# Altium project Boost and Buck Converter Circuit.PrjPcb
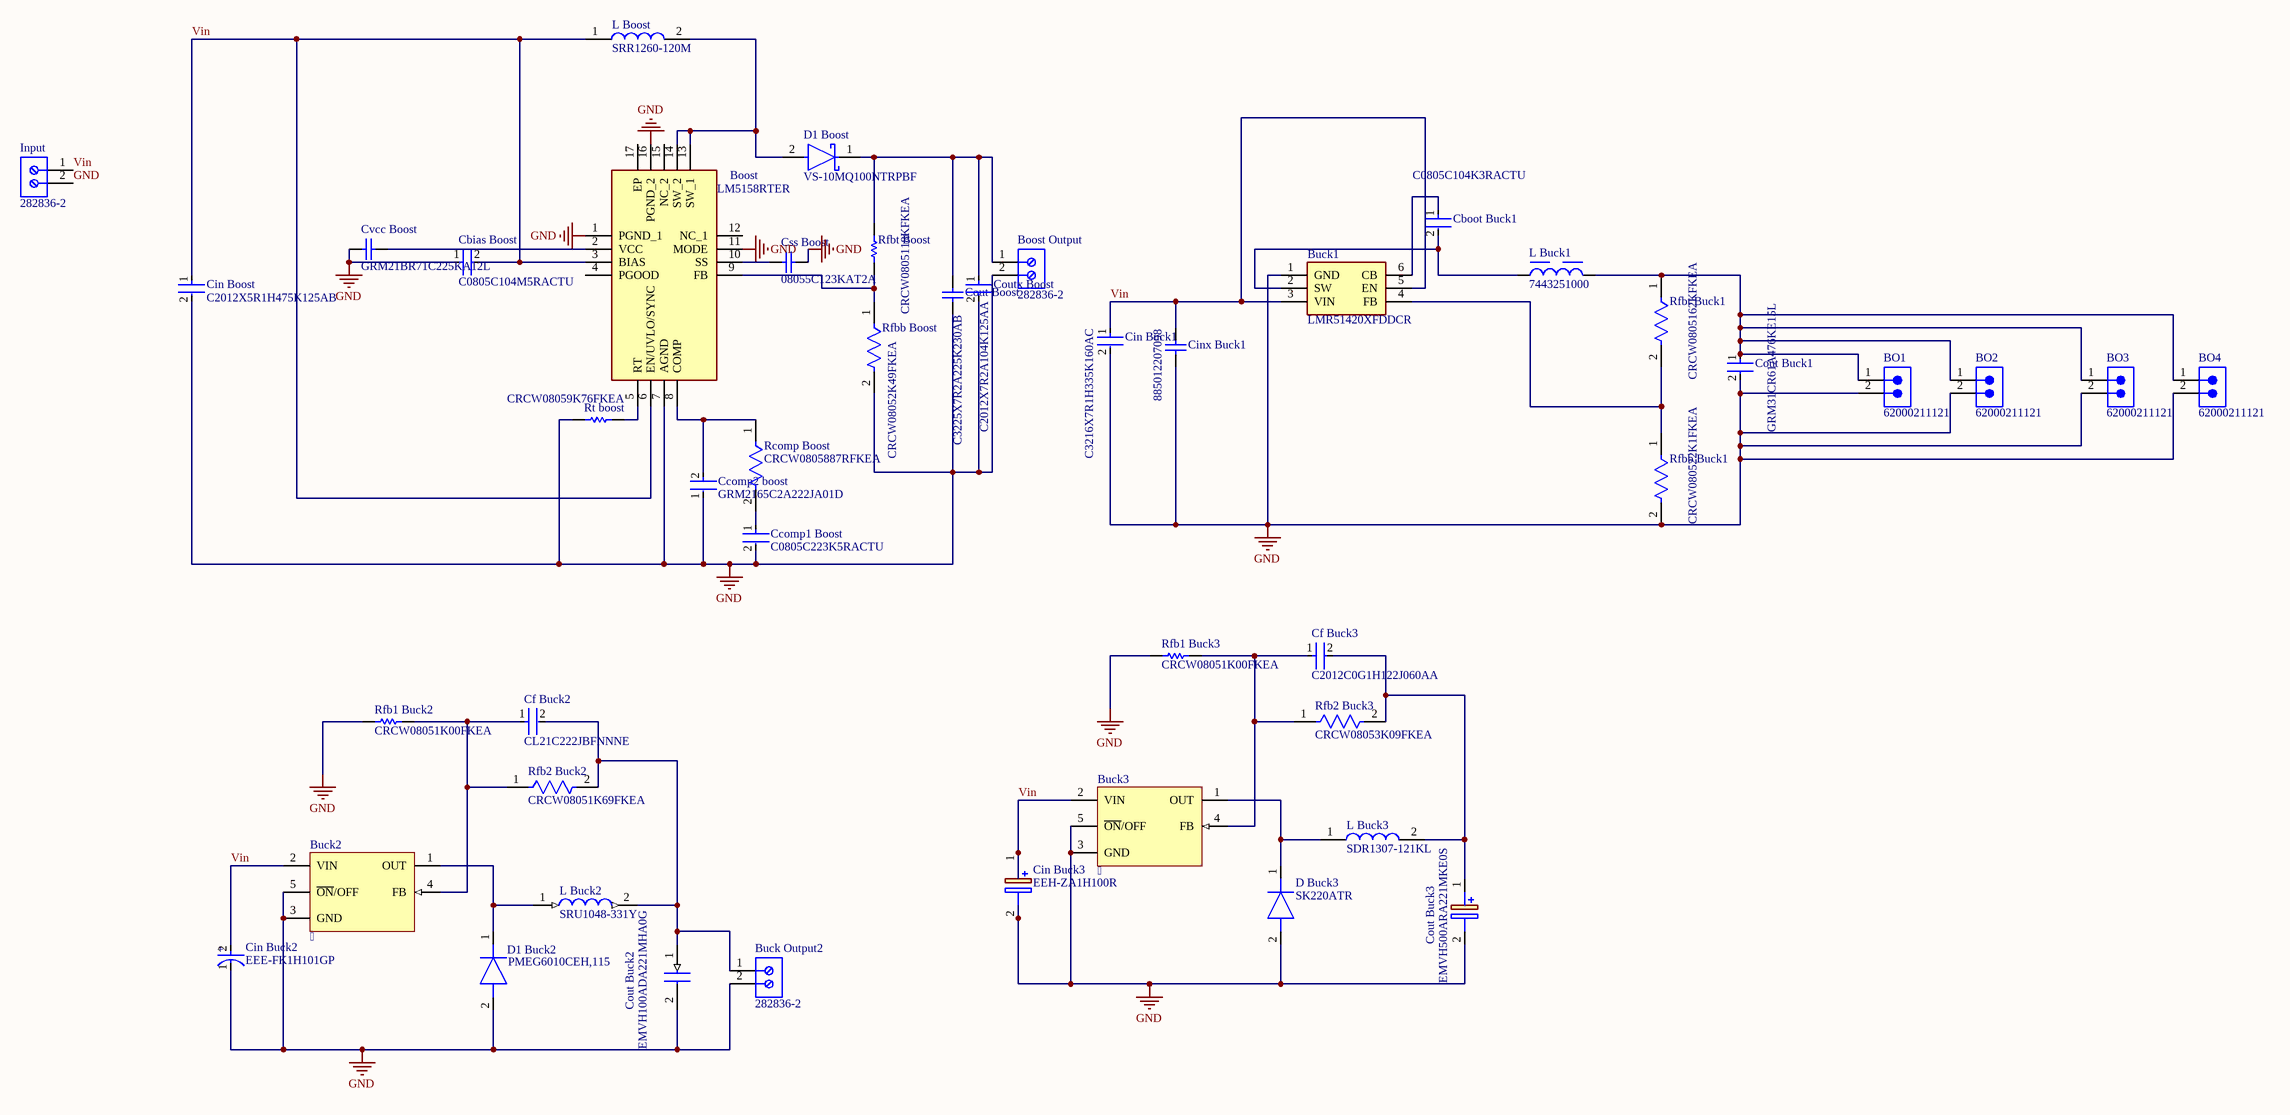
[diagram p0: Power Converter Schematic.SchDoc]
1 sheet, 46 parts. Net scope: global (net labels, ports and power ports of the same name join across sheets).
Board file: Power Converter PCB.PcbDoc

## Sheet Power Converter Schematic.SchDoc
size C; SheetNumber: 1; SheetTotal: 1

### Parts
BO1  62000211121  [62000211121]
BO2  62000211121  [62000211121]
BO3  62000211121  [62000211121]
BO4  62000211121  [62000211121]
Boost  LM5158RTER  [QFN50P300X300X80-17N-D]
Boost_Output  282836-2  [TECO-282836-2_V]
Buck1  LMR51420XFDDCR  [SOT95P280X110-6N]
Buck2    [NDH0005A]
Buck3    [NDH0005A]
Buck_Output2  282836-2  [TECO-282836-2_V]
Cbias_Boost  C0805C104M5RACTU  [FP-C0805C-DN-MFG]
Cboot_Buck1  C0805C104K3RACTU  [FP-C0805C-DN-MFG]
Ccomp1_Boost  C0805C223K5RACTU  [FP-C0805C-DN-MFG]
Ccomp2_boost  GRM2165C2A222JA01D  [FP-GRM216-0_1-IPC_A]
Cf_Buck2  CL21C222JBFNNNE  [FP-CL21-IPC_C]
Cf_Buck3  C2012C0G1H122J060AA  [FP-C2012-060-0_2-IPC_B]
Cin_Boost  C2012X5R1H475K125AB  [FP-C2012-125-0_2-IPC_B]
Cin_Buck1  C3216X7R1H335K160AC  [FP-C3216-160-0_2-IPC_A]
Cin_Buck2  EEE-FK1H101GP  [FP-FKF-MFG]
Cin_Buck3  EEH-ZA1H100R  [EEHZA1H100R]
Cinx_Buck1  885012207098  [WCAP-CSGP_0805_L2W1.25H0.8_Reflow]
Cout_Boost  C3225X7R2A225K230AB  [CAPC3225X250X20LL40]
Cout_Buck1  GRM31CR61A476KE15L  [FP-GRM31C-0_2-e0_3_0_8-MFG]
Cout_Buck2  EMVH100ADA221MHA0G  [CAPAE830X1050N]
Cout_Buck3  EMVH500ARA221MKE0S  [CAPAE1300X1400N]
Coutx_Boost  C2012X7R2A104K125AA  [FP-C2012-125-0_2-IPC_B]
Css_Boost  08055C123KAT2A  [CAPC2013X94X50ML20T25]
Cvcc_Boost  GRM21BR71C225KA12L  [CAPC2013X135X50ML10T20]
D1_Boost  VS-10MQ100NTRPBF  [FP-95400-MFG]
D1_Buck2  PMEG6010CEH,115  [SODFL3516X120N]
D_Buck3  SK220ATR  [DIOM5226X295N]
Input  282836-2  [TECO-282836-2_V]
L_Boost  SRR1260-120M  [SRR1260120M]
L_Buck1  7443251000  [WE-HCI_1050]
L_Buck2  SRU1048-331Y  [INDPM100100X510N]
L_Buck3  SDR1307-121KL  [SDR1307102KL]
Rcomp_Boost  CRCW0805887RFKEA  [FP-CRCW0805-e3-IPC_B]
Rfb1_Buck2  CRCW08051K00FKEA  [RESC2013X50X30NL20T20]
Rfb1_Buck3  CRCW08051K00FKEA  [RESC2013X50X30NL20T20]
Rfb2_Buck2  CRCW08051K69FKEA  [FP-CRCW0805-e3-IPC_A]
Rfb2_Buck3  CRCW08053K09FKEA  [FP-CRCW0805-e3-IPC_C]
Rfbb_Boost  CRCW08052K49FKEA  [FP-CRCW0805-e3-IPC_A]
Rfbb_Buck1  CRCW080522K1FKEA  [FP-CRCW0805-e3-IPC_C]
Rfbt_Boost  CRCW0805118KFKEA  [RESC2013X50X30ML20T20]
Rfbt_Buck1  CRCW0805162KFKEA  [FP-CRCW0805-e3-IPC_C]
Rt_boost  CRCW08059K76FKEA  [RESC2013X50X30NL20T20]

### Nets
GND: BO1.2 BO2.2 BO3.2 BO4.2 Boost.1(PGND_1) Boost.7(AGND) Boost.11(MODE) Boost.16(PGND_2) Boost_Output.2 Buck1.1(GND) Buck2.3(GND) Buck2.5(~{ON}/OFF) Buck3.3(GND) Buck3.5(~{ON}/OFF) Buck_Output2.2 Cbias_Boost.1 Ccomp1_Boost.2 Ccomp2_boost.1 Cin_Boost.2 Cin_Buck1.2 Cin_Buck2.1(C) Cin_Buck3.2(-) Cinx_Buck1.1 Cout_Boost.1 Cout_Buck1.2 Cout_Buck2.2(-) Cout_Buck3.2(-) Coutx_Boost.2 Css_Boost.2 Cvcc_Boost.1 D1_Buck2.2(A) D_Buck3.2(A) Input.2 Rfb1_Buck2.1 Rfb1_Buck3.1 Rfbb_Boost.2 Rfbb_Buck1.2 Rt_boost.2
Vin: Boost.3(BIAS) Boost.6(EN/UVLO/SYNC) Buck1.3(VIN) Buck1.5(EN) Buck2.2(VIN) Buck3.2(VIN) Cbias_Boost.2 Cin_Boost.1 Cin_Buck1.1 Cin_Buck2.2(A) Cin_Buck3.1(+) Cinx_Buck1.2 Input.1 L_Boost.1
NetBO1_1: BO1.1 BO2.1 BO3.1 BO4.1 Cout_Buck1.1 L_Buck1.2 Rfbt_Buck1.1
NetBoost_2: Boost.2(VCC) Cvcc_Boost.2
NetBoost_5: Boost.5(RT) Rt_boost.1
NetBoost_8: Boost.8(COMP) Ccomp2_boost.2 Rcomp_Boost.1
NetBoost_9: Boost.9(FB) Rfbb_Boost.1 Rfbt_Boost.2
NetBoost_10: Boost.10(SS) Css_Boost.1
NetBoost_13: Boost.13(SW_1) Boost.14(SW_2) D1_Boost.2(A) L_Boost.2
NetBoost_Output_1: Boost_Output.1 Cout_Boost.2 Coutx_Boost.1 D1_Boost.1(C) Rfbt_Boost.1
NetBuck1_2: Buck1.2(SW) Cboot_Buck1.2 L_Buck1.1
NetBuck1_4: Buck1.4(FB) Rfbb_Buck1.1 Rfbt_Buck1.2
NetBuck1_6: Buck1.6(CB) Cboot_Buck1.1
NetBuck2_1: Buck2.1(OUT) D1_Buck2.1(K) L_Buck2.1
NetBuck2_4: Buck2.4(FB) Cf_Buck2.1 Rfb1_Buck2.2 Rfb2_Buck2.1
NetBuck3_1: Buck3.1(OUT) D_Buck3.1(K) L_Buck3.1
NetBuck3_4: Buck3.4(FB) Cf_Buck3.1 Rfb1_Buck3.2 Rfb2_Buck3.1
NetBuck_Output2_1: Buck_Output2.1 Cf_Buck2.2 Cout_Buck2.1(+) L_Buck2.2 Rfb2_Buck2.2
NetCcomp1_Boost_1: Ccomp1_Boost.1 Rcomp_Boost.2
NetCf_Buck3_2: Cf_Buck3.2 Cout_Buck3.1(+) L_Buck3.2 Rfb2_Buck3.2

Not connected (* = marked no-connect by the designer): Boost 4(PGOOD) 12(NC_1) 15(NC_2) 17(EP)

### Notes on the sheet
- (in symbol CMP-05427-000032-1) +

### Library data of the parts
BO1-BO4 = CMP-1502-00956-3: NexarPartId: 61924778; Number of Contacts: 2; Voltage Rating: 200V; Gender: Male; Contact Resistance: 20mΩ; Current Rating: 2A; Lead Pitch: 2mm; Max Operating Temperature: 105°C; Contact Material: Gold; Number of Rows: 1; Operating Supply Voltage: 200V; Number of Pins: 2; Orientation: Vertical; Min Operating Temperature: -40°C; Height: 6.35mm; RoHS: Non-Compliant
Boost = LM5158RTER: Integrated Circuit; Manufacturer_Name: Texas Instruments; Datasheet Link: https://www.ti.com/lit/ds/symlink/lm51581.pdf?HQS=dis-dk-null-digikeymode-dsf-pf-null-wwe&ts=1701945457348; Height: 0.8mm; Manufacturer_Part_Number: LM5158RTER; Mouser Part Number: 595-LM5158RTER; Mouser Price/Stock: https://www.mouser.co.uk/ProductDetail/Texas-Instruments/LM5158RTER?qs=A6eO%252BMLsxmSi4gKDMJ7mCQ%3D%3D; Arrow Part Number: LM5158RTER; Arrow Price/Stock: https://www.arrow.com/en/products/lm5158rter/texas-instruments?region=nac
Boost_Output Buck_Output2 Input = CMP-1684-00017-1: Female Header, Pitch 5 mm, 1 x 2 Position, Height 10 mm, Tail Length 3.5 mm, Rohs, Bulk; Manufacturer: TE Connectivity; Wire Gauge: 16-30AWG; Product Training Modules: Wire-to-BoardEurostyleTerminalBlocks; Clamp Material - Plating: Brass-NickelPlated; Voltage: 300V; Mating Orientation: HorizontalwithBoard; Current: 13.5A; Pitch: 0.197"(5.00mm); Screw Thread: M3; 3D Model: 282836-2.pdf; Other Names: 5ULV-02B / A98076; Dynamic Catalog: BuchananSeries; Number of Levels: 1; Torque - Screw: 0.68Nm(6Lb-In); Featured Product: EurostyleTerminalBlockConnectors; Positions Per Level: 2; Wire Termination: Screw-RisingCageClamp; Datasheet URL: http://www.te.com.cn/commerce/DocumentDelivery/DDEController?Action=showdoc&DocId=Catalog+Section%7F1308389_EUROSTYLE_TERMINAL_BLOCKS%7F0607%7Fpdf%7FEnglish%7FENG_CS_1308389_EUROSTYLE_TERMINAL_BLOCKS_0607.pdf%7F282836-2; Color: Green; Family: TerminalBlocks-WiretoBoard; RoHS Information: 282836-2StatementofCompliance; Standard Package: 300; Contact Material - Plating: Brass-TinPlated; Manufacturer URL: http://www.te.com; Housing Material: Polyamide(PA66),Nylon6/6; Features: Interlocking(Side); Package Description: Female Header, Pitch 5 mm, 1 x 2 Position, Height 10 mm, Tail Length 3.5 mm; Mounting Type: ThroughHole; Package Reference: THD; Packaging: Bulk; Series: Buchanan; Category: Connectors,Interconnects; Screw Material - Plating: Brass-NickelPlated
Buck1 = LMR51420XFDDCR: Integrated Circuit; Manufacturer_Name: Texas Instruments; Datasheet Link: https://www.ti.com/lit/ds/symlink/lmr51420.pdf?ts=1662461097045&ref_url=https%253A%252F%252Fwww.ti.com%252Fproduct%252FLMR51420%252Fpart-details%252FLMR51420XFDDCR; Height: 1.1mm; Manufacturer_Part_Number: LMR51420XFDDCR; Mouser Part Number: 595-LMR51420XFDDCR; Mouser Price/Stock: https://www.mouser.co.uk/ProductDetail/Texas-Instruments/LMR51420XFDDCR?qs=vvQtp7zwQdMiXKT41134nA%3D%3D; Arrow Part Number: LMR51420XFDDCR; Arrow Price/Stock: https://www.arrow.com/en/products/lmr51420xfddcr/texas-instruments?region=nac
Buck2 Buck3 = CMP-0069-01920-3: SIMPLE SWITCHER® Power Converter 150 KHz 1A Step-Down Voltage Regulator, 5-pin TO-220, Pb-Free; Manufacturer: Texas Instruments; PackageTopMarking: NSUZXYTTE#*LM2595T*-ADJ P+; PowerWise: N; ComponentLink1Description: Datasheet URL; CompType: Switcher; PackageReference: NDH0005A; ComponentLink1URL: http://www.ti.com/general/docs/lit/getliterature.tsp?genericPartNumber=LM2595&fileType=pdf; PackageDescription: TO-220, Molded, Stagger Bend, 5 Lead; RoHS: Y; PinCount: 5
Cbias_Boost = CMP-1036-04423-3: CAP CER 0.1UF 50V X7R 0805; Manufacturer: KEMET; Tolerance: 0.2; Temperature Coefficient: 30ppm/°C; Capacitance: 0.10 μF; Value: 0.10 μF; Temperature: -55°C to +125°C; RoHS: TRUE; Temperature Range Low: -55°C; Device Class L3: Ceramic Capacitors; Manufacturer Part Number: C0805C104M5RACTU; Octopart: https://octopart.com/c0805c104m5ractu-kemet-129379; Ipc Land Pattern Name: CAPC200125X78; Mouser Description: Multilayer Ceramic Capacitors MLCC - SMD/SMT 50volts 0.1uF X7R 20%; Temperature Range High: +125°C; Material: Ceramic; Package: C0805C-DN; Temperature Characteristic: X7R; Automotive: No; ComponentLink2URL: https://content.kemet.com/datasheets/KEM_C1003_C0G_SMD.pdf; Device Class L1: Passive Components; ComponentLink2Description: Datasheet; Device Class L2: Capacitors; Voltage Rating: 50 V; Digikey Description: CAP CER 0.1UF 50V X7R 0805; Lead Free: Yes; Height: 0.88mm; Category: Cap
Cboot_Buck1 = CMP-2007-01100-2: CAP CER 0.1UF 25V X7R 0805; Manufacturer: KEMET; Capacitance: 0.10 μF; Tolerance: 0.1; Value: 0.10 μF; Temperature Coefficient: 30ppm/°C; Temperature Characteristic: X7R; Octopart: https://octopart.com/c0805c104k3ractu-kemet-136827; Device Class L2: Capacitors; Device Class L1: Passive Components; Category: Cap; Device Class L3: Ceramic Capacitors; Voltage Rating: 25 V; ComponentLink2Description: Datasheet; Automotive: No; Package: C0805C-DN; RoHS: TRUE; Temperature Range High: +125°C; Temperature Range Low: -55°C; Height: 0.88mm; Temperature: -55°C to +125°C; Digikey Description: CAP CER 0.1UF 25V X7R 0805; Ipc Land Pattern Name: CAPC200125X78; Material: Ceramic; Lead Free: Yes; Manufacturer Part Number: C0805C104K3RACTU; ComponentLink2URL: https://content.kemet.com/datasheets/KEM_C1003_C0G_SMD.pdf; Mouser Description: Multilayer Ceramic Capacitor, C Series, 0.1 - F, - 10%, X7R, 25 V, 0805 [2012 Metric] Rohs Compliant: Yes
Ccomp1_Boost = CMP-2007-00338-2: CAP CER 0.022UF 50V X7R 0805; Manufacturer: KEMET; Value: 22,000 pF; Tolerance: 0.1; Temperature Coefficient: 30ppm/°C; Automotive: No; Package: C0805C-DN; RoHS: TRUE; Height: 0.88mm; Lead Free: Yes; Temperature Range Low: -55°C; Digikey Description: CAP CER 0.022UF 50V X7R 0805; ComponentLink2Description: Datasheet; Capacitance: 22,000 pF; Mouser Description: Capacitor; Ceramic; Cap; .022uF; Tol 10%; SMT; Vol-Rtg 50V; X7R; Tape and Reel; Device Class L3: Ceramic Capacitors; Category: Cap; Voltage Rating: 50 V; Temperature Characteristic: X7R; Ipc Land Pattern Name: CAPC200125X78; Manufacturer Part Number: C0805C223K5RACTU; Octopart: https://octopart.com/c0805c223k5ractu-kemet-145968; Device Class L1: Passive Components; Temperature: -55°C to +125°C; Material: Ceramic; ComponentLink2URL: https://content.kemet.com/datasheets/KEM_C1003_C0G_SMD.pdf; Temperature Range High: +125°C; Device Class L2: Capacitors
Ccomp2_boost = CMP-1036-03272-5: Chip Multilayer Ceramic Capacitors for General Purpose, 0805, 2200pF, C0G, 30ppm/°C, 5%, 100V; Capacitance: 2.2nF; Case Code (Metric): 2012; Thickness: 0.028inch; Mount: Surface Mount; Termination: SMD/SMT; Voltage Rating: 100V; Package Quantity: 4000; Max Operating Temperature: 125°C; Case Code (Imperial): 0805; Height: 0.6mm; Dielectric: C0G; Radiation Hardening: No; Case/Package: 0805; Packaging: Tape and Reel; Depth: 1.25mm; Construction: Flat; RoHS Compliant: Yes; Width: 0.049inch; Tolerance: 5%; Length: 2mm; Voltage Rating (DC): 100V; Series: GRM; Min Operating Temperature: -55°C
Cf_Buck2 = CMP-13271-001564-1: CL21 Series 0805 2.2nF 50V ±5% Tolerance C0G Multilayer Ceramic Chip Capacitor; Mount: Surface Mount; Packaging: Tape and Reel; Tolerance: 5%; Thickness: 0.053inch; Case Code (Imperial): 0805; Capacitance: 2.2nF; Min Operating Temperature: -55°C; Width: 0.049inch; Package Quantity: 2000; Depth: 1.25mm; Radiation Hardening: No; Voltage Rating (DC): 50V; Case/Package: 0805; Voltage: 50V; Max Operating Temperature: 125°C; Case Code (Metric): 2012; Voltage Rating: 50V; Length: 2mm; Dielectric: C0G; Height: 1.25mm; Lead Free: Lead Free
Cf_Buck3 = CMP-08246-006887-1: Multilayer Ceramic Capacitors 1.2nF ±5% 50V C0G SMD 0805; Temperature Coefficient: 30ppm/°C; REACH SVHC: No SVHC; Max Operating Temperature: 125°C; Length: 2mm; Voltage Rating (DC): 50V; Termination: SMD/SMT; Packaging: Tape and Reel; Min Operating Temperature: -55°C; Case Code (Imperial): 0805; Voltage Rating: 50V; Dielectric Material: Ceramic; Voltage: 50V; Series: C; Weight: 0.000194oz; Width: 0.049inch; Radiation Hardening: No; Mount: Surface Mount; Tolerance: 5%; Lead Free: Lead Free; Thickness: 0.028inch; Height: 0.6mm; Capacitance: 1.2nF; Construction: Flat; Case Code (Metric): 2012; Dielectric: C0G; Case/Package: 0805; Depth: 1.25mm; RoHS Compliant: Yes; Package Quantity: 1
Cin_Boost = CMP-08246-000007-2: Multilayer Ceramic Capacitors 4.7μF ±10% 50V X5R SMD 0805; Capacitance: 4.7uF; Case Code (Metric): 2012; Weight: 0.000194oz; Voltage Rating: 50V; Voltage: 50V; Construction: Flat; Series: C; Packaging: Tape and Reel; Height: 1.25mm; Depth: 1.25mm; Resistor Type: Ceramic; Width: 0.049inch; Length: 2mm; Thickness: 0.057inch; REACH SVHC: No SVHC; Max Operating Temperature: 85°C; Case/Package: 0805; Dielectric: X5R; Tolerance: 10%; Dielectric Material: Ceramic; Package Quantity: 1; Mount: Surface Mount; Radiation Hardening: No; Voltage Rating (DC): 50V; Case Code (Imperial): 0805; Termination: SMD/SMT; Min Operating Temperature: -55°C; Lead Free: Lead Free
Cin_Buck1 = CMP-08246-006965-1: Multilayer Ceramic Capacitors 3.3uF ±10% 50V X7R SMD 1206; Package Quantity: 1; Construction: Flat; Depth: 1.6mm; Packaging: Tape and Reel; Mount: Surface Mount; Max Operating Temperature: 125°C; Resistor Type: Ceramic; Tolerance: 10%; Capacitance: 3.3uF; Termination: SMD/SMT; REACH SVHC: No SVHC; Lead Free: Lead Free; Dielectric: X7R; Height: 1.6mm; Radiation Hardening: No; Width: 1.6mm; Voltage Rating: 50V; Case Code (Imperial): 1206; Series: C; Case Code (Metric): 3216; RoHS Compliant: Yes; Case/Package: 1206; Dielectric Material: Ceramic; Thickness: 0.051inch; Min Operating Temperature: -55°C; Weight: 0.000571oz; Length: 3.2mm; Voltage Rating (DC): 50V
Cin_Buck2 = CMP-05427-000032-1: CAP ALUM 100UF 20% 50V SMD; Ripple Current (AC): 350mA; Impedance: 340mR; Life (Hours): 5000Hour; Leakage Current: 10mA; Voltage: 50V; Voltage Rating (DC): 50V; ESR (Equivalent Series Resistance): 340mR; Packaging: Tape and Reel; Radiation Hardening: No; Construction: Cylindrical; Case/Package: SMD/SMT; Contact Plating: Tin; Min Operating Temperature: -55°C; Lead Free: Lead Free; Mount: Surface Mount; Number of Pins: 2; Height: 10.2mm; Tolerance: 20%; Package Quantity: 1; Voltage Rating: 50V; Termination: SMD/SMT; Width: 10mm; Max Operating Temperature: 105°C; Height - Seated (Max): 0.402inch; RoHS Compliant: Yes; Ripple Current: 350mA; Length: 10.2mm; Capacitance: 100uF; Series: FK; REACH SVHC: No SVHC; Diameter: 8mm
Cin_Buck3 = EEH-ZA1H100R: Capacitor Polarised; Manufacturer_Name: Panasonic; Datasheet Link: http://industrial.panasonic.com/cdbs/www-data/pdf/RDD0000/ABA0000C1221.pdf; Height: 6.1mm; Manufacturer_Part_Number: EEH-ZA1H100R; Mouser Part Number: 667-EEH-ZA1H100R; Mouser Price/Stock: https://www.mouser.co.uk/ProductDetail/Panasonic/EEH-ZA1H100R?qs=7UCyOFMWVHYLkHnrAgGq6g%3D%3D; Arrow Part Number: EEH-ZA1H100R; Arrow Price/Stock: https://www.arrow.com/en/products/eehza1h100r/panasonic
Cinx_Buck1 = CMP-03913-65419869-1: 885012207098 Ceramic Capacitor, Multilayer, Ceramic, 50V, 10% +Tol, 10% -Tol, X7R, 15% TC, 0.1uF, Surface Mount, 0805; Capacitance: 100nF; Insulation Resistance: 5GΩ; RoHS: Compliant; Height: 800µm; Tolerance: 10%; Voltage Rating (DC): 50V; Packaging: Tape & Reel (TR); Case Code (Metric): 2012; NexarPartId: 65419869; Mount: Surface Mount; Width: 1.25mm; Min Operating Temperature: -55°C; Dielectric: X7R; Max Operating Temperature: 125°C; Material: Ceramic; Case Code (Imperial): 0805; REACH SVHC: Unknown; Thickness: 889µm; Voltage Rating: 50V; Length: 2mm; Case/Package: 0805
Cout_Boost = CMP-2000-06053-1: Chip Capacitor, 2.2 uF, +/- 10%, -55 to 125 degC, 1210 (3225 Metric), RoHS, Tape and Reel; PCN Part Number: MLCCPartNumberChange30/Nov/2012; Manufacturer: TDK; Capacitance: 2.2µF; Catalog Drawings: CSERIES_1210_2.5; Product Training Modules: SEAT,CCV,andTVCLDesignToolsGuidetoReplacinganElectrolyticCapacitorwithanMLCC; Other Names: 445-4497-6; Voltage - Rated: 100V; Temperature Coefficient: X7R; Featured Product: C-SeriesMidVoltageMLCCs; Online Catalog: CSeries,MidVoltage; Ratings: -; Mounting Technology: SurfaceMount; Height - Seated (Max): -; Applications: GeneralPurpose; Packaging: Digi-Reel®; Mounting Type: SurfaceMount,MLCC; Lead Spacing: -; Thickness (Max): 0.098"(2.50mm); Package Reference: 1210 (3225 Metric); Manufacturer URL: http://www.tdk.com/; Size / Dimension: 0.126"Lx0.098"W(3.20mmx2.50mm); Operating Temperature: -55°C~125°C; Datasheet URL: https://datasheet.ciiva.com/15192/getdatasheetpartid-725361-15192330.pdf; RoHS Information: RoHSCertificate-MLCC; Lead Style: -; Standard Package: 1; Family: CeramicCapacitors; Datasheet Version: 10/2014; Category: Capacitors; Tolerance: ±10%; Features: -; Series: C; Package Description: 2-Pin Surface Mount Device, Body 3.2 x 2.5 mm; Package / Case: 1210(3225Metric)
Cout_Buck1 = CMP-06035-015661-1: Chip Multilayer Ceramic Capacitors for General Purpose, 1206, 47uF, X5R, 15%, 10%, 10V; Case/Package: 1206; Min Operating Temperature: -55°C; REACH SVHC: No SVHC; Mount: Surface Mount; Height: 1.6mm; Thickness: 0.071inch; Packaging: Tape and Reel; Tolerance: 10%; Dielectric: X5R; Case Code (Imperial): 1206; Lead Free: Lead Free; Width: 1.6mm; Voltage Rating (DC): 10V; Material: Ceramic; Max Operating Temperature: 85°C; Voltage: 10V; Package Quantity: 2000; Case Code (Metric): 3216; Termination: SMD/SMT; Voltage Rating: 10V; Depth: 1.6mm; Length: 3.2mm; Capacitance: 47uF
Cout_Buck2 = EMVH100ADA221MHA0G: Capacitor; Manufacturer_Name: Chemi-Con; Datasheet Link: https://www.mouser.com/datasheet/2/420/MVHRA_e-2509159.pdf; Height: 10.5mm; Manufacturer_Part_Number: EMVH100ADA221MHA0G
Cout_Buck3 = EMVH500ARA221MKE0S: Capacitor Polarised; Manufacturer_Name: Chemi-Con; Datasheet Link: https://datasheet.datasheetarchive.com/originals/distributors/Datasheets_SAMA/00faa400e29ccc6bfe274dba95f85cbe.pdf; Height: 14mm; Manufacturer_Part_Number: EMVH500ARA221MKE0S; Mouser Part Number: 661-MVH50V221M; Mouser Price/Stock: https://www.mouser.co.uk/ProductDetail/Chemi-Con/EMVH500ARA221MKE0S?qs=2mc6vmdPgIHrG5zINcyyrQ%3D%3D
Coutx_Boost = CMP-08246-005364-1: Multilayer Ceramic Capacitors 100nF ±10% 100V X7R SMD 0805; Packaging: Tape and Reel; Length: 2mm; Number of Pins: 2; Voltage Rating: 100V; Min Operating Temperature: -55°C; Height: 1.25mm; Radiation Hardening: No; Termination: SMD/SMT; Weight: 0.000194oz; Case Code (Imperial): 0805; Max Operating Temperature: 125°C; Voltage: 100V; Capacitance: 100nF; Thickness: 0.057inch; Width: 0.049inch; Resistor Type: Ceramic; Package Quantity: 1; Tolerance: 10%; Mount: Surface Mount; Depth: 1.25mm; Series: C; Lead Free: Lead Free; Case/Package: 0805; Voltage Rating (DC): 100V; Dielectric: X7R; Case Code (Metric): 2012; RoHS Compliant: Yes; REACH SVHC: No SVHC; Construction: Flat
Css_Boost = CMP-2007-04376-1: Manufacturer: AVX Interconnect / Elco; Part Number: 08055C123KAT2A
Cvcc_Boost = CMP-2007-03455-1: Manufacturer: Murata; Part Number: GRM21BR71C225KA12L
D1_Boost = CMP-02539-000001-1: DIODE SCHOTTKY 100V 1A SMA; Manufacturer: Vishay; Forward Current: 1.5A; Max Surge Forward Current: 30A; Standoff Height: 0mm; Value: 38pF; Max Junction Temp: +150°C; Peak Reverse Current: 0.1mA; Octopart: https://octopart.com/vs-10mq100ntrpbf-vishay-44340924; Max Repetitive Reverse Voltage: 100V; ComponentLink2Description: Datasheet; ComponentLink2URL: http://www.vishay.com/docs/94119/vs-10mq100ntrpbf.pdf; Reverse Voltage: 100V; Digikey Description: DIODE SCHOTTKY 100V 1A SMA; Mouser Description: DIODE SCHOTTKY 100V 1A SMA; Lead Free: Yes; Device Class L2: Diodes; Temperature Range Low: -55°C; Package: 95400; Height: 2.29mm; Capacitance: 38pF; Device Class L1: Discrete Semiconductors; Footprint Url: https://www.vishay.com/docs/95400/sma.pdf; Temperature: -55°C to +150°C; Temperature Range High: +150°C; RoHS: TRUE; Category: Diode; Manufacturer Part Number: VS-10MQ100NTRPBF; Device Class L3: Schottky Diodes; Automotive: No
D1_Buck2 = PMEG6010CEH,115: Diode; Manufacturer_Name: Nexperia; Datasheet Link: https://assets.nexperia.com/documents/data-sheet/PMEG6010CEH_PMEG6010CEJ.pdf; Height: 1.2mm; Manufacturer_Part_Number: PMEG6010CEH,115; Mouser Part Number: 771-PMEG6010CEH-T/R; Mouser Price/Stock: https://www.mouser.co.uk/ProductDetail/Nexperia/PMEG6010CEH115?qs=LOCUfHb8d9uyulDQGIpcOA%3D%3D; Arrow Part Number: PMEG6010CEH,115; Arrow Price/Stock: https://www.arrow.com/en/products/pmeg6010ceh115/nexperia?region=europe
D_Buck3 = SK220ATR: Diode; Manufacturer_Name: SMC Diode Solutions; Datasheet Link: http://www.smc-diodes.com/propdf/SK220A%20N0942%20REV.B.pdf; Height: 2.95mm; Manufacturer_Part_Number: SK220ATR
L_Boost = SRR1260-120M: Inductor; Manufacturer_Name: Bourns; Datasheet Link: https://www.bourns.com/docs/Product-Datasheets/SRR1260.pdf; Height: 6.5mm; Manufacturer_Part_Number: SRR1260-120M; Mouser Part Number: 652-SRR1260-120M; Mouser Price/Stock: https://www.mouser.co.uk/ProductDetail/Bourns/SRR1260-120M?qs=%2FPiZ59IM4y1THIjATaheJA%3D%3D; Arrow Part Number: SRR1260-120M; Arrow Price/Stock: https://www.arrow.com/en/products/srr1260-120m/bourns?region=nac
L_Buck1 = CMP-03913-24533220-1: 7443251000 Power Choke Shielded Wirewound 10uH/7.6uH 20% 100KHz 7.2A 16.3mOhm DCR T/R; Series Resistance: 16.3Ω; Inductance: 10µH; Self Resonant Frequency: 21MHz; DC Resistance (DCR): 16.3mΩ; Saturation Current: 8.5A; Tolerance: 20%; Ambient Temperature Range High: 100°C; Ambient Temperature Range Low: -40°C; Max DC Current: 7.2A; Packaging: Digi-Reel®; Height - Seated (Max): 5.0038mm; NexarPartId: 24533220; Number of Pins: 2; RMS Current (Irms): 7.2A; Case/Package: Nonstandard; Composition: Wirewound; Inductance Tolerance: 20%; Width: 10.2mm; Shielding: Shielded; Lead Free: Lead Free; Length: 10.5mm; Min Operating Temperature: -40°C; Max Operating Temperature: 150°C; Current Rating: 7.2A; REACH SVHC: Unknown; Height: 4.7mm; RoHS: Compliant; Termination: SMD/SMT; Mount: Surface Mount; Test Frequency: 100kHz
L_Buck2 = SRU1048-331Y: Inductor; Manufacturer_Name: Bourns; Datasheet Link: http://uk.rs-online.com/web/p/products/1729735; Height: 5.1mm; Manufacturer_Part_Number: SRU1048-331Y
L_Buck3 = SDR1307-121KL: Inductor; Manufacturer_Name: Bourns; Datasheet Link: https://datasheet.datasheetarchive.com/originals/dk/DKDS-12/225042.pdf; Height: 7.3mm; Manufacturer_Part_Number: SDR1307-121KL; Mouser Part Number: 652-SDR1307-121KL; Mouser Price/Stock: https://www.mouser.co.uk/ProductDetail/Bourns/SDR1307-121KL?qs=y9m3SKnhpLM5rTTayljzjg%3D%3D; Arrow Part Number: SDR1307-121KL; Arrow Price/Stock: https://www.arrow.com/en/products/sdr1307-121kl/bourns
Rcomp_Boost = CMP-2001-04145-2: RES Thick Film, 887Ω, 1%, 0.125W, 100ppm/°C, 0805; Power Rating: 125mW; Voltage Rating (DC): 150V; Resistance: 887R; Contact Plating: Tin; Packaging: Tape and Reel; Width: 0.049inch; Temperature Coefficient: 100ppm/°C; Features: Automotive AEC-Q200; Max Operating Temperature: 155°C; Radiation Hardening: No; Depth: 1.25mm; Case Code (Imperial): 0805; Composition: Thick Film; Voltage Rating: 150V; Number of Pins: 2; Lead Free: Lead Free; Package Quantity: 10; Height: 0.45mm; Case Code (Metric): 2012; Weight: 0.000194oz; Max Power Dissipation: 125mW; Min Operating Temperature: -55°C; Tolerance: 1%; Termination: SMD/SMT; Number of Terminations: 2; Length: 2mm; Military Standard: Not; Case/Package: 0805
Rfb1_Buck2 Rfb1_Buck3 = CMP-1013-00510-2: Manufacturer: Vishay Dale; Part Number: CRCW08051K00FKEA
Rfb2_Buck2 = CMP-2001-03620-2: RES Thick Film, 1.69kΩ, 1%, 0.125W, 100ppm/°C, 0805; Voltage Rating: 150V; Resistance: 1.69kR; Power Rating: 125mW; Min Operating Temperature: -55°C; Depth: 1.25mm; Case Code (Imperial): 0805; Temperature Coefficient: 100ppm/°C; Lead Free: Lead Free; Military Standard: Not; Package Quantity: 10; Features: Automotive AEC-Q200; Case Code (Metric): 2012; Case/Package: 0805; Packaging: Tape and Reel; Length: 2mm; Composition: Thick Film; Radiation Hardening: No; Tolerance: 1%; Number of Terminations: 2; Height: 0.45mm; Contact Plating: Tin; Max Power Dissipation: 125mW; Weight: 0.000194oz; Voltage Rating (DC): 150V; Width: 1.25mm; Max Operating Temperature: 155°C; Termination: SMD/SMT
Rfb2_Buck3 = CMP-2001-03873-2: RES Thick Film, 3.09kΩ, 1%, 0.125W, 100ppm/°C, 0805; Max Power Dissipation: 125mW; Voltage Rating (DC): 150V; Resistance: 3.09kR; Power Rating: 125mW; Package Quantity: 10; Height: 0.02inch; Min Operating Temperature: -55°C; Number of Terminations: 2; Case Code (Metric): 2012; Case/Package: 0805; Composition: Thick Film; Max Operating Temperature: 155°C; Tolerance: 1%; Depth: 1.25mm; Number of Pins: 2; Packaging: Tape and Reel; Width: 0.049inch; Temperature Coefficient: 100ppm/°C; Voltage Rating: 150V; Military Standard: Not; Weight: 0.000194oz; Features: Automotive AEC-Q200; Case Code (Imperial): 0805; Radiation Hardening: No; Contact Plating: Tin; Lead Free: Lead Free; Length: 2mm; Termination: Solder
Rfbb_Boost = CMP-2001-03771-2: RES Thick Film, 2.49kΩ, 1%, 0.125W, 100ppm/°C, 0805; Voltage Rating: 150V; Resistance: 2.49kR; Max Power Dissipation: 125mW; Packaging: Tape and Reel; Case/Package: 0805; Lead Free: Lead Free; Case Code (Imperial): 0805; Width: 0.049inch; Depth: 1.25mm; Tolerance: 1%; Voltage Rating (DC): 150V; Package Quantity: 10; Length: 2mm; Termination: SMD/SMT; Temperature Coefficient: 100ppm/°C; Height: 0.45mm; Case Code (Metric): 2012; Number of Pins: 2; Composition: Thick Film; Contact Plating: Tin; Number of Terminations: 2; Weight: 0.000194oz; Max Operating Temperature: 155°C; Military Standard: Not; Features: Automotive AEC-Q200; Radiation Hardening: No; Power Rating: 125mW; Min Operating Temperature: -55°C
Rfbb_Buck1 = CMP-2001-03689-2: RES Thick Film, 22.1kΩ, 1%, 0.125W, 100ppm/°C, 0805; Voltage Rating (DC): 150V; Max Power Dissipation: 125mW; Resistance: 22.1kR; Voltage Rating: 150V; Height: 0.45mm; Packaging: Tape and Reel; Lead Free: Lead Free; Composition: Thick Film; Temperature Coefficient: 100ppm/°C; Depth: 1.25mm; Length: 2mm; Case Code (Metric): 2012; Number of Terminations: 2; Case/Package: 0805; Termination: SMD/SMT; Power Rating: 125mW; Package Quantity: 10; Max Operating Temperature: 155°C; Radiation Hardening: No; Width: 1.25mm; Military Standard: Not; Weight: 0.000194oz; Contact Plating: Tin; Min Operating Temperature: -55°C; Features: Automotive AEC-Q200; Case Code (Imperial): 0805; Tolerance: 1%
Rfbt_Boost = CMP-2001-04922-1: Manufacturer: Vishay Dale; Part Number: CRCW0805118KFKEA
Rfbt_Buck1 = CMP-2001-04975-2: RES Thick Film, 162kΩ, 1%, 0.125W, 100ppm/°C, 0805; Voltage Rating: 150V; Power Rating: 125mW; Resistance: 162kR; Weight: 0.000194oz; Military Standard: Not; Number of Pins: 2; Max Operating Temperature: 155°C; Temperature Coefficient: 100ppm/°C; Features: Automotive AEC-Q200; Voltage Rating (DC): 150V; Radiation Hardening: No; Case/Package: 0805; Height: 0.45mm; Depth: 1.25mm; Length: 2mm; Number of Terminations: 2; Package Quantity: 10; Max Power Dissipation: 125mW; Lead Free: Lead Free; Packaging: Tape and Reel; Composition: Thick Film; Tolerance: 1%; Termination: SMD/SMT; Contact Plating: Tin; Width: 0.049inch; Case Code (Metric): 2012; Case Code (Imperial): 0805; Min Operating Temperature: -55°C
Rt_boost = CMP-2001-04181-1: Manufacturer: Vishay Dale; Part Number: CRCW08059K76FKEA